# EAGLE design Artemis Charger Mod PCB (EAGLE 7.5.0)
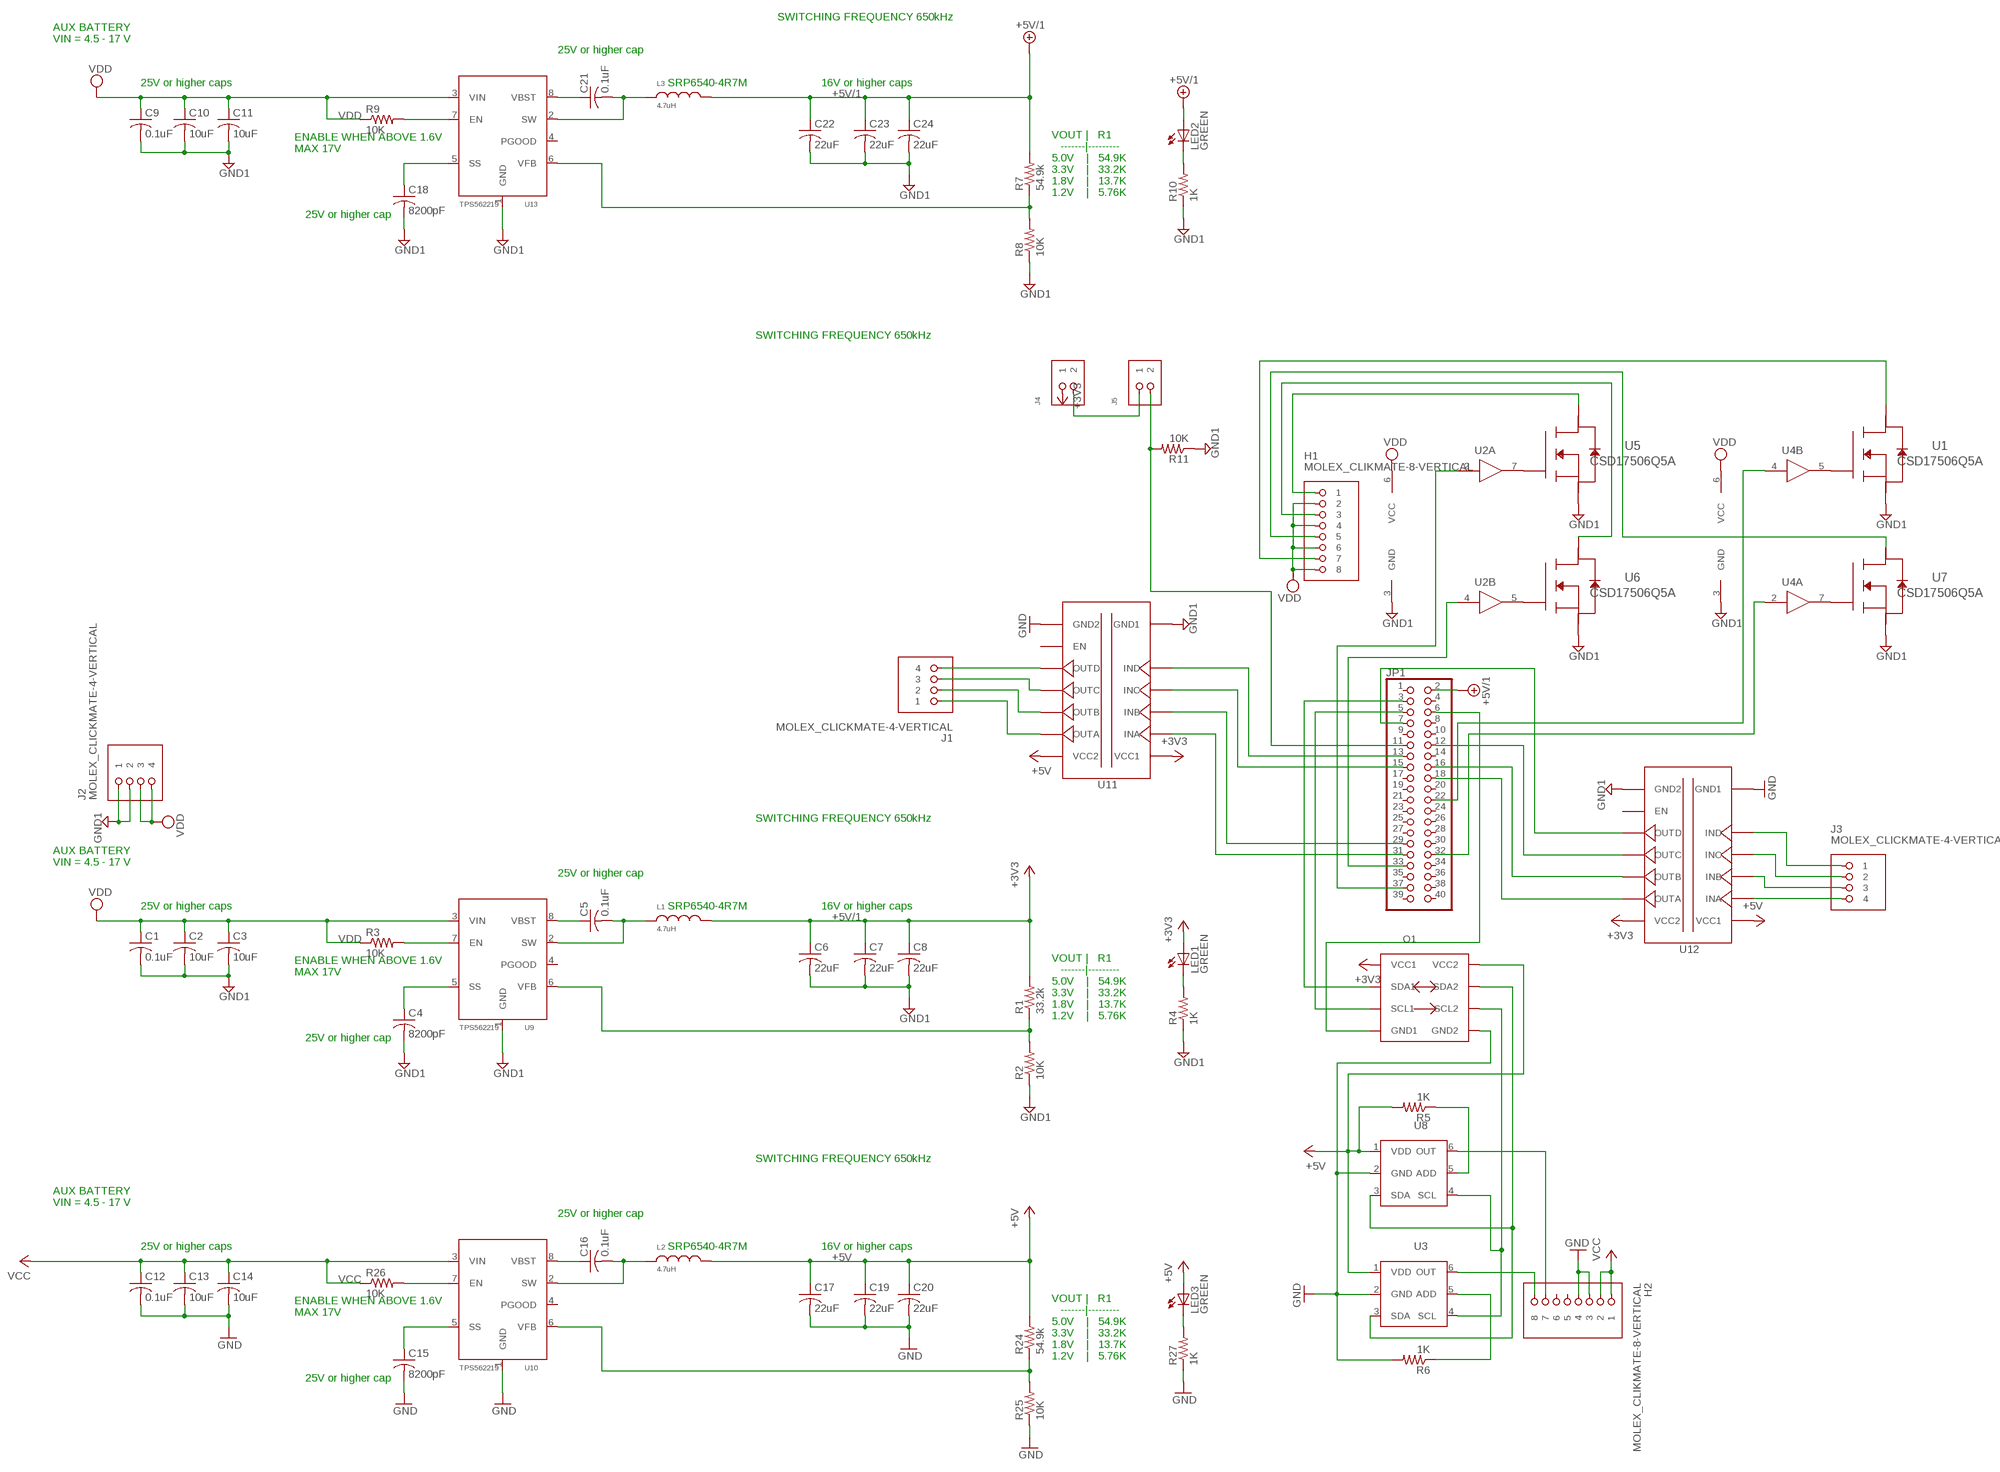
[diagram p0: schematic, sheet 1]

## Parts
C1  0.1uF  C-USC0805  [C0805]
C2  10uF  C-USC0805  [C0805]
C3  10uF  C-USC0805  [C0805]
C4  8200pF  C-USC0805  [C0805]
C5  0.1uF  C-USC0805  [C0805]
C6  22uF  C-USC0805  [C0805]
C7  22uF  C-USC0805  [C0805]
C8  22uF  C-USC0805  [C0805]
C9  0.1uF  C-USC0805  [C0805]
C10  10uF  C-USC0805  [C0805]
C11  10uF  C-USC0805  [C0805]
C12  0.1uF  C-USC0805  [C0805]
C13  10uF  C-USC0805  [C0805]
C14  10uF  C-USC0805  [C0805]
C15  8200pF  C-USC0805  [C0805]
C16  0.1uF  C-USC0805  [C0805]
C17  22uF  C-USC0805  [C0805]
C18  8200pF  C-USC0805  [C0805]
C19  22uF  C-USC0805  [C0805]
C20  22uF  C-USC0805  [C0805]
C21  0.1uF  C-USC0805  [C0805]
C22  22uF  C-USC0805  [C0805]
C23  22uF  C-USC0805  [C0805]
C24  22uF  C-USC0805  [C0805]
H1  MOLEX_CLIKMATE-8-VERTICAL  [MOLEX-CLIKMATE-8-VERTICAL-HEADER]
H2  MOLEX_CLIKMATE-8-VERTICAL  [MOLEX-CLIKMATE-8-VERTICAL-HEADER]
J1  MOLEX_CLICKMATE-4-VERTICAL  [MOLEX-CLIKMATE-4-VERTICAL-HEADER]
J2  MOLEX_CLICKMATE-4-VERTICAL  [MOLEX-CLIKMATE-4-VERTICAL-HEADER]
J3  MOLEX_CLICKMATE-4-VERTICAL  [MOLEX-CLIKMATE-4-VERTICAL-HEADER]
J4  MOLEX_CLICKMATE-2-VERTICAL  [MOLEX-CLIKMATE-2-VERTICAL-HEADER]
J5  MOLEX_CLICKMATE-2-VERTICAL  [MOLEX-CLIKMATE-2-VERTICAL-HEADER]
JP1  PINHD-2X20  [2X20]
L1  4.7uH  SRP6540  [SRP6540]
L2  4.7uH  SRP6540  [SRP6540]
L3  4.7uH  SRP6540  [SRP6540]
LED1  GREEN  LEDCHIPLED_0805  [CHIPLED_0805]
LED2  GREEN  LEDCHIPLED_0805  [CHIPLED_0805]
LED3  GREEN  LEDCHIPLED_0805  [CHIPLED_0805]
O1  ISO1541  [ISO1541]
R1  33.2k  R-US_R0805  [R0805]
R2  10K  R-US_R0805  [R0805]
R3  10K  R-US_R0805  [R0805]
R4  1K  R-US_R0805  [R0805]
R5  1K  R-US_R0805  [R0805]
R6  1K  R-US_R0805  [R0805]
R7  54.9k  R-US_R0805  [R0805]
R8  10K  R-US_R0805  [R0805]
R9  10K  R-US_R0805  [R0805]
R10  1K  R-US_R0805  [R0805]
R11  10K  R-US_R0805  [R0805]
R24  54.9k  R-US_R0805  [R0805]
R25  10K  R-US_R0805  [R0805]
R26  10K  R-US_R0805  [R0805]
R27  1K  R-US_R0805  [R0805]
U1  CSD17506Q5A  [SON_5X6]
U2  FAN3214  [FAN3214]
U3  MAX5812  MAX5812M  [MAX5812]
U4  FAN3214  [FAN3214]
U5  CSD17506Q5A  [SON_5X6]
U6  CSD17506Q5A  [SON_5X6]
U7  CSD17506Q5A  [SON_5X6]
U8  MAX5812  MAX5812M  [MAX5812]
U9  TPS562219  [TPS562219]
U10  TPS562219  [TPS562219]
U11  ISO7340  [ISO734X]
U12  ISO7340  [ISO734X]
U13  TPS562219  [TPS562219]

## Nets
+5V: C17.1 C19.1 C20.1 L2.P$2 LED3.A O1.8(VCC2) R5.2 R24.2 U3.1(VDD) U8.1(VDD) U11.P$16(VCC2) U12.P$1(VCC1)
+5V/1: C6.1 C7.1 C8.1 C22.1 C23.1 C24.1 J4.1 JP1.2 L1.P$2 L3.P$2 LED1.A LED2.A O1.1(VCC1) R1.2 R7.2 U11.P$1(VCC1) U12.P$16(VCC2) ; supply symbol labelled +3V3
GND: C12.2 C13.2 C14.2 C15.2 C17.2 C19.2 C20.2 H2.3 H2.4 O1.5(GND2) R6.2 R25.1 R27.1 U3.2(GND) U8.2(GND) U10.1(GND) U11.P$9(GND2) U11.P$15(GND2) U12.P$2(GND1) U12.P$8(GND1)
GND1: C1.2 C2.2 C3.2 C4.2 C6.2 C7.2 C8.2 C9.2 C10.2 C11.2 C18.2 C22.2 C23.2 C24.2 J2.1 J2.2 R2.1 R4.1 R8.1 R10.1 R11.1 U1.1(S) U1.2(S) U1.3(S) U2.3(GND) U4.3(GND) U5.1(S) U5.2(S) U5.3(S) U6.1(S) U6.2(S) U6.3(S) U7.1(S) U7.2(S) U7.3(S) U9.1(GND) U11.P$2(GND1) U11.P$8(GND1) U12.P$9(GND2) U12.P$15(GND2) U13.1(GND)
N$1: R3.2 U9.7(EN)
N$2: LED1.C R4.2
N$3: U2.5(B:OUT) U6.4(G)
N$4: R5.1 U8.5(ADD)
N$5: JP1.31 U11.P$3(INA)
N$6: U4.7(A:OUT) U7.4(G)
N$7: O1.7(SDA2) U3.3(SDA) U8.3(SDA)
N$8: O1.6(SCL2) U3.4(SCL) U8.4(SCL)
N$9: JP1.3 O1.2(SDA1)
N$10: JP1.5 O1.3(SCL1)
N$11: R6.1 U3.5(ADD)
N$12: U1.4(G) U4.5(B:OUT)
N$13: JP1.32 U4.2(A:IN)
N$14: U2.7(A:OUT) U5.4(G)
N$15: JP1.33 U2.4(B:IN)
N$16: JP1.37 U2.2(A:IN)
N$17: JP1.22 U4.4(B:IN)
N$18: JP1.6 O1.4(GND1)
N$19: H1.1 U5.5(D) U5.6(D) U5.7(D) U5.8(D) U5.PAD1(D) U5.PAD(D) U5.VIA1(D) U5.VIA2(D) U5.VIA3(D) U5.VIA4(D) U5.VIA5(D) U5.VIA6(D) U5.VIA7(D) U5.VIA8(D) U5.VIA9(D)
N$20: H1.3 U6.5(D) U6.6(D) U6.7(D) U6.8(D) U6.PAD1(D) U6.PAD(D) U6.VIA1(D) U6.VIA2(D) U6.VIA3(D) U6.VIA4(D) U6.VIA5(D) U6.VIA6(D) U6.VIA7(D) U6.VIA8(D) U6.VIA9(D)
N$21: H1.5 U7.5(D) U7.6(D) U7.7(D) U7.8(D) U7.PAD1(D) U7.PAD(D) U7.VIA1(D) U7.VIA2(D) U7.VIA3(D) U7.VIA4(D) U7.VIA5(D) U7.VIA6(D) U7.VIA7(D) U7.VIA8(D) U7.VIA9(D)
N$22: H1.7 U1.5(D) U1.6(D) U1.7(D) U1.8(D) U1.PAD1(D) U1.PAD(D) U1.VIA1(D) U1.VIA2(D) U1.VIA3(D) U1.VIA4(D) U1.VIA5(D) U1.VIA6(D) U1.VIA7(D) U1.VIA8(D) U1.VIA9(D)
N$23: R26.2 U10.7(EN)
N$24: JP1.29 U11.P$4(INB)
N$25: H2.8 U3.6(OUT)
N$26: H2.7 U8.6(OUT)
N$27: JP1.13 U11.P$6(IND)
N$28: LED3.C R27.2
N$29: JP1.15 U11.P$5(INC)
N$30: J1.4 U11.P$11(OUTD)
N$31: J1.3 U11.P$12(OUTC)
N$32: J1.2 U11.P$13(OUTB)
N$33: J1.1 U11.P$14(OUTA)
N$34: J3.4 U12.P$3(INA)
N$35: J3.3 U12.P$4(INB)
N$36: J3.2 U12.P$5(INC)
N$37: J3.1 U12.P$6(IND)
N$38: JP1.18 U12.P$14(OUTA)
N$39: JP1.16 U12.P$13(OUTB)
N$40: JP1.12 U12.P$12(OUTC)
N$41: JP1.7 U12.P$11(OUTD)
N$42: J4.2 J5.1
N$43: J5.2 JP1.11 R11.2
N$44: R9.2 U13.7(EN)
N$45: LED2.C R10.2
SS_5V: C15.1 U10.5(SS)
SS_5V1: C4.1 U9.5(SS)
SS_5V2: C18.1 U13.5(SS)
SW_5V: C16.2 L2.P$1 U10.2(SW)
SW_5V1: C5.2 L1.P$1 U9.2(SW)
SW_5V2: C21.2 L3.P$1 U13.2(SW)
VBST_5V: C16.1 U10.8(VBST)
VBST_5V1: C5.1 U9.8(VBST)
VBST_5V2: C21.1 U13.8(VBST)
VCC: C12.1 C13.1 C14.1 H2.1 H2.2 R26.1 U10.3(VIN)
VDD: C1.1 C2.1 C3.1 C9.1 C10.1 C11.1 H1.2 H1.4 H1.6 H1.8 J2.3 J2.4 R3.1 R9.1 U2.6(VCC) U4.6(VCC) U9.3(VIN) U13.3(VIN)
VFB_5V: R24.1 R25.2 U10.6(VFB)
VFB_5V1: R1.1 R2.2 U9.6(VFB)
VFB_5V2: R7.1 R8.2 U13.6(VFB)
Unconnected: H2.5 H2.6 JP1.1 JP1.4 JP1.8 JP1.9 JP1.10 JP1.14 JP1.17 JP1.19 JP1.20 JP1.21 JP1.23 JP1.24 JP1.25 JP1.26 JP1.27 JP1.28 JP1.30 JP1.34 JP1.35 JP1.36 JP1.38 JP1.39 JP1.40 U9.4(PGOOD) U10.4(PGOOD) U11.P$10(EN) U12.P$10(EN) U13.4(PGOOD)

## Notes on the sheet
- SWITCHING FREQUENCY 650kHz
- AUX BATTERY
  VIN = 4.5 - 17 V
- 25V or higher cap
- 25V or higher caps | SRP6540-4R7M | 16V or higher caps
- ENABLE WHEN ABOVE 1.6V
  MAX 17V
- VOUT |   R1
     -------|---------
  5.0V    |   54.9K
  3.3V    |   33.2K
  1.8V    |   13.7K
  1.2V    |   5.76K
- 25V or higher cap
- SWITCHING FREQUENCY 650kHz
- SWITCHING FREQUENCY 650kHz
- AUX BATTERY
  VIN = 4.5 - 17 V
- 25V or higher cap
- 25V or higher caps | SRP6540-4R7M | 16V or higher caps
- ENABLE WHEN ABOVE 1.6V
  MAX 17V
- VOUT |   R1
     -------|---------
  5.0V    |   54.9K
  3.3V    |   33.2K
  1.8V    |   13.7K
  1.2V    |   5.76K
- 25V or higher cap
- SWITCHING FREQUENCY 650kHz
- AUX BATTERY
  VIN = 4.5 - 17 V
- 25V or higher cap
- 25V or higher caps | SRP6540-4R7M | 16V or higher caps
- ENABLE WHEN ABOVE 1.6V
  MAX 17V
- VOUT |   R1
     -------|---------
  5.0V    |   54.9K
  3.3V    |   33.2K
  1.8V    |   13.7K
  1.2V    |   5.76K
- 25V or higher cap

## Library data of the parts
C1 C5 C9 C12 C16 C21 = adafruit:C-US: CAPACITOR, American symbol; PARTNO: GRM21BR71E104KA01L
C2 C3 C10 C11 C13 C14 = adafruit:C-US: CAPACITOR, American symbol; PARTNO: GRM21BR61E106KA73L
C4 C15 C18 = adafruit:C-US: CAPACITOR, American symbol; PARTNO: C0805C822K5RACTU
C6-C8 C17 C19 C20 C22-C24 = adafruit:C-US: CAPACITOR, American symbol; PARTNO: C2012JB1E226M125AC
H1 H2 = FormE:MOLEX_CLIKMATE-8-VERTICAL: 505405-0860
J1-J3 = FormE:MOLEX_CLICKMATE-4-VERTICAL: 5025840470
J4 J5 = FormE:MOLEX_CLICKMATE-2-VERTICAL: 5025840270
JP1 = pinhead:PINHD-2X20: PIN HEADER
L1-L3 = FormE:SRP6540; PARTNO: SRP6540-4R7M
LED1-LED3 = FormE:LED: LED OSRAM: - CHIPLED LG R971, LG N971, LY N971, LG Q971, LY Q971, LO R971, LY R971 LH N974, LH R974 LS Q976, LO Q976, LY Q976 LO Q996 - Hyper CHIPLED LW Q18S LB Q993, LB Q99A, LB R99A - SideLED LS A670, LO A670, LY A670, LG A670, LP A670 LB A673, LV A673, LT A673, LW A673 LH A674 LY A675 LS A676, LA A676, LO A676, LY A676, LW A676 LS A679, LY A679, LG A679 - Hyper Micro SIDELED® LS Y876, LA Y876, LO Y876, LY Y876 LT Y87S - SmartLED LW L88C, LW L88S LB L89C, LB L89S, LG L890 LS L89K, LO L89K, LY L89K LS L896, LA L896, LO L896, LY L896 - TOPLED LS T670, LO T670, LY T670, LG T670, LP T670 LSG T670, LSP T670, LSY T670, LOP T670, LYG T670 LG T671, LOG T671, LSG T671 LB T673, LV T673, LT T673, LW T673 LH T674 LS T676, LA T676, LO T676, LY T676, LB T676, LH T676, LSB T676, LW T676 LB T67C, LV T67C, LT T67C, LS T67K, LO T67K, LY T67K, LW E67C LS E67B, LA E67B, LO E67B, LY E67B, LB E67C, LV E67C, LT E67C LW T67C LS T679, LY T679, LG T679 LS T770, LO T770, LY T770, LG T770, LP T770 LB T773, LV T773, LT T773, LW T773 LH T774 LS E675, LA E675, LY E675, LS T675 LS T776, LA T776, LO T776, LY T776, LB T776 LHGB T686 LT T68C, LB T68C - Hyper Mini TOPLED® LB M676 - Mini TOPLED Santana® LG M470 LS M47K, LO M47K, LY M47K Source: http://www.osram.convergy.de/; PARTNO: 598-8170-107F
O1 = FormE:ISO1541
R1 R7 R24 = adafruit:R-US_: RESISTOR, American symbol; PARTNO: ERA-6AEB5492V
R2 R3 R8 R9 R11 R25 R26 = adafruit:R-US_: RESISTOR, American symbol; PARTNO: ERJ-6ENF1002V
R4-R6 R10 R27 = adafruit:R-US_: RESISTOR, American symbol; PARTNO: ERJ-6ENF1001V
U1 U5-U7 = FormE:CSD17506Q5A
U2 U4 = FormE:FAN3214
U3 U8 = FormE:MAX5812
U9 U10 U13 = FormE:TPS562219; PARTNO: TPS562219DDFT
U11 U12 = FormE:ISO7340

## Board
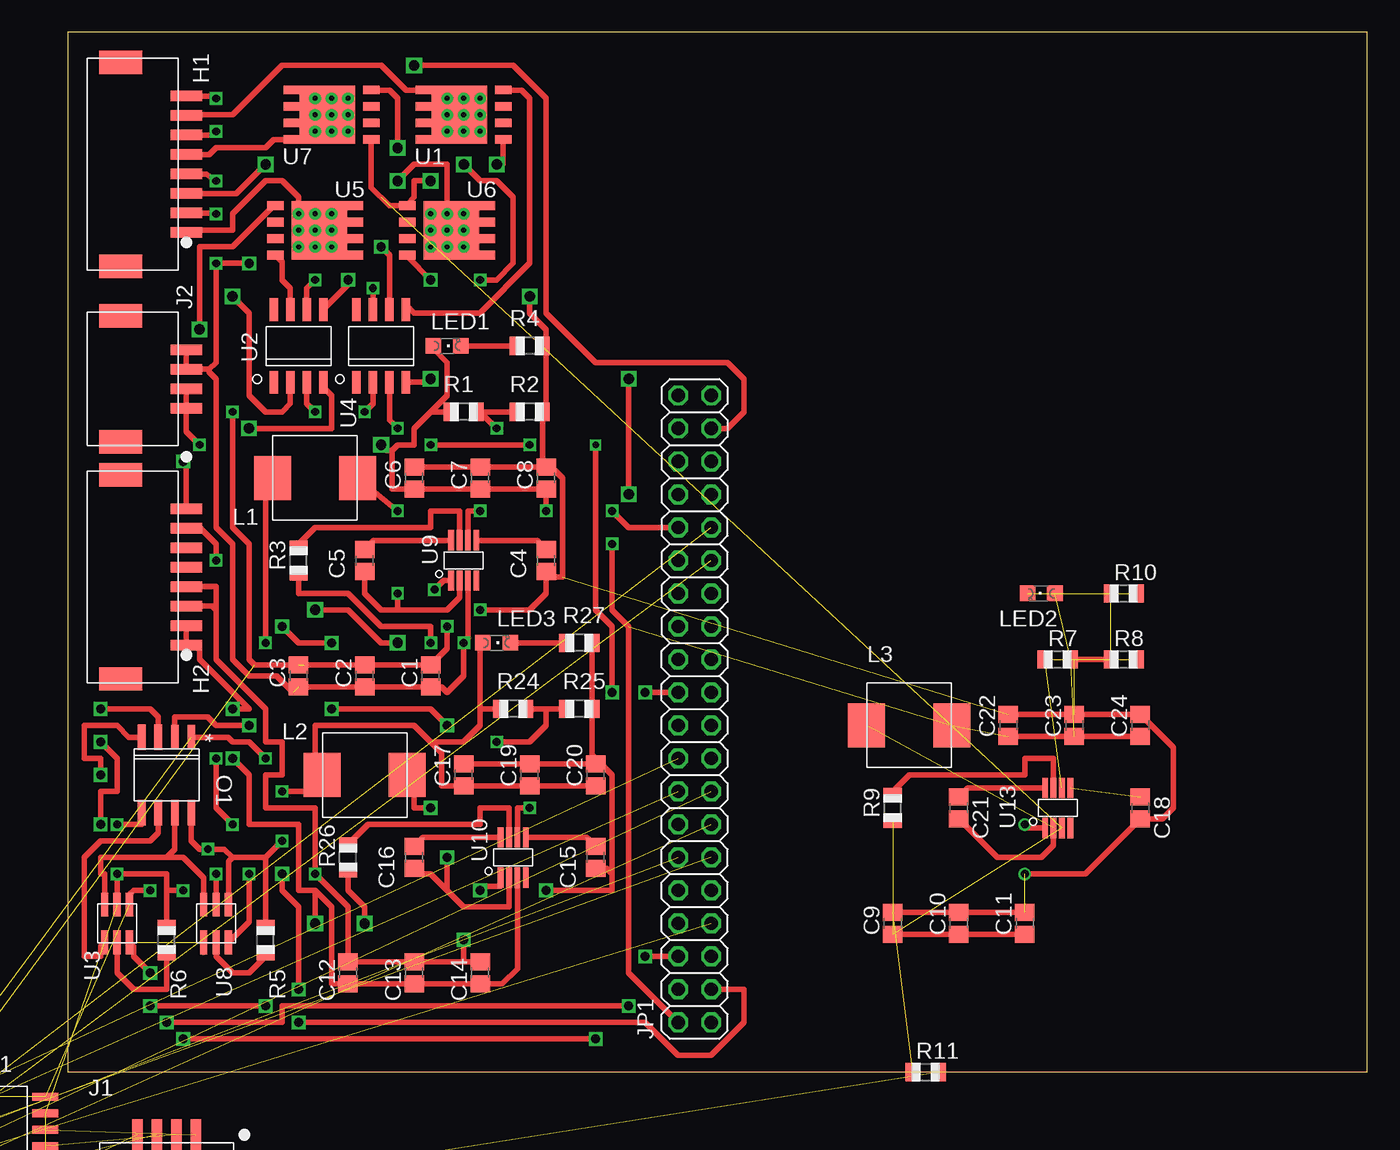
[diagram p1: board, top side]
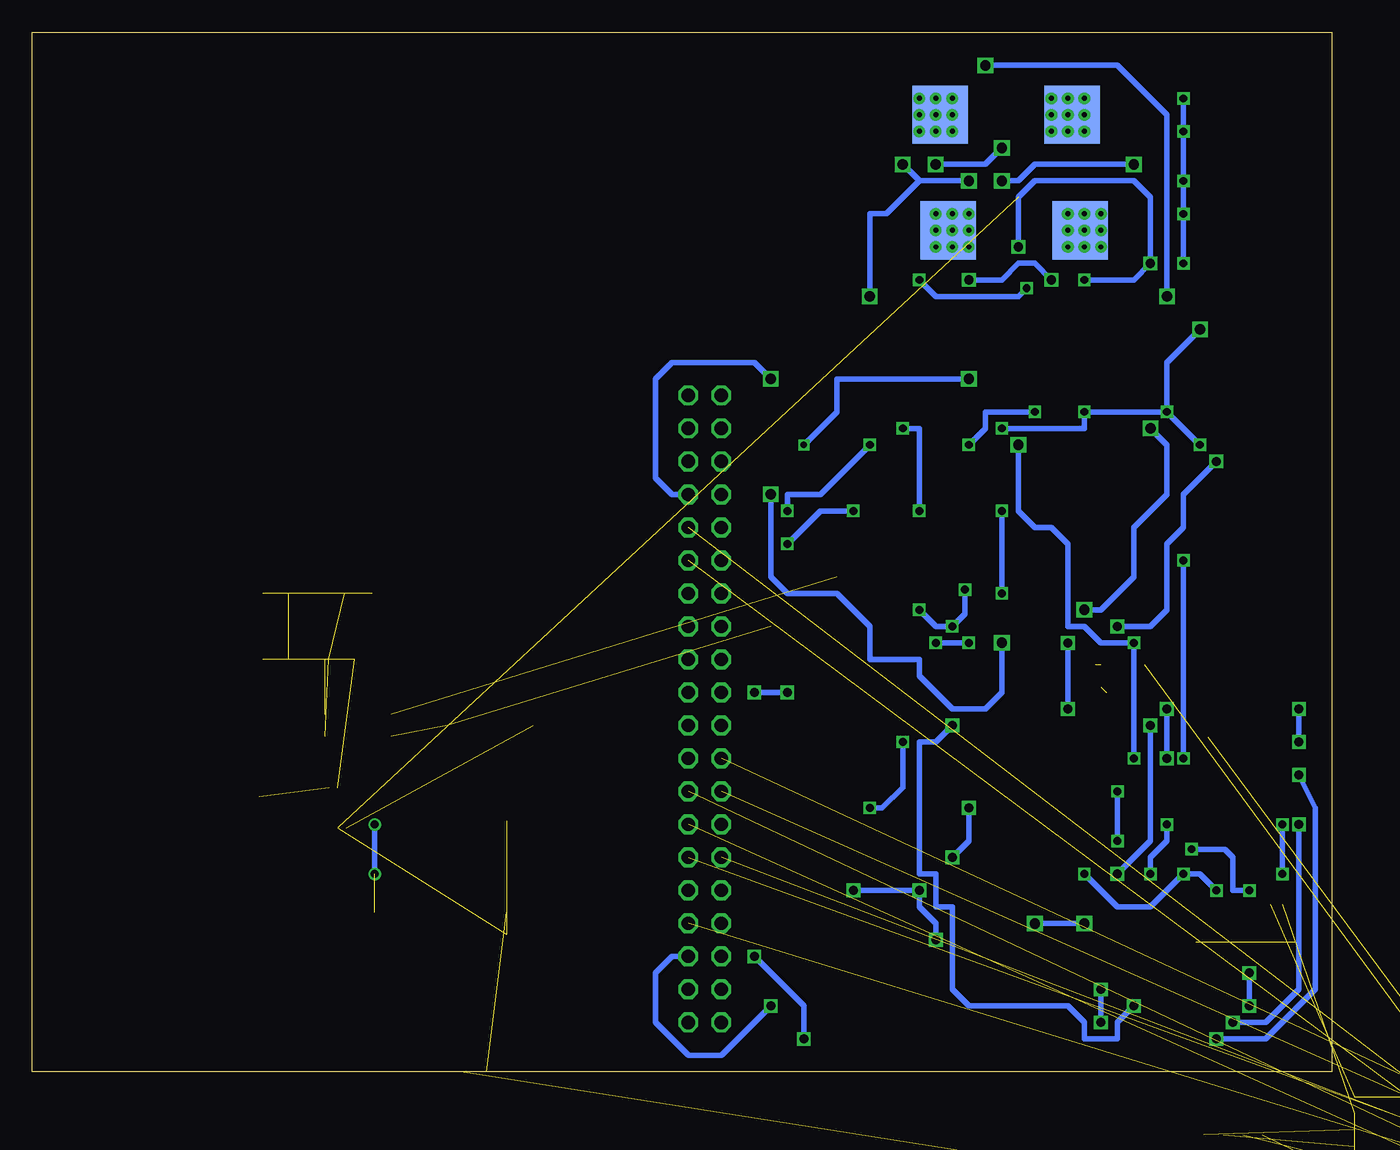
[diagram p2: board, bottom side, seen from below]

Size 100 x 80 mm. Coordinates in mm from the lower left corner, seen from the top.
Outline: 0,0 100,0 100,80 0,80 0,0
Copper layers (1*16): Top 0.0356mm / dielectric 1.5011mm / Bottom 0.0356mm
Design rules "OSH_PCB Rules": minimum track width 6mil, minimum drill 13mil, track to track 6mil, track to pad 6mil, pad to pad 6mil, via to via 6mil, smd to smd 6mil, copper to edge 15mil, drill to drill 6mil, minimum pad ring 7mil, minimum via ring 7mil, stop-mask expansion 3mil, vias tented up to drill 0mil, thermal gap 10mil

### Footprints (pad centres in the part's own frame; a part is rotated, then mirrored left to right if it is on the bottom)
C0805 = smd 1.3 x 1.5: 1 -0.85,0; 2 0.85,0
MOLEX-CLIKMATE-8-VERTICAL-HEADER = smd 0.8 x 2.4: 1 5.25,4.064; 2 3.75,4.064; 3 2.25,4.064; 4 0.75,4.064; 5 -0.75,4.064; 6 -2.25,4.064; 7 -3.75,4.064; 8 -5.25,4.064 | smd 1.8 x 3.3: M1 7.85,-0.986; M2 -7.85,-0.986
MOLEX-CLIKMATE-4-VERTICAL-HEADER = smd 0.8 x 2.4: 1 2.25,4.064; 2 0.75,4.064; 3 -0.75,4.064; 4 -2.25,4.064 | smd 1.8 x 3.3: M1 4.85,-0.986; M2 -4.85,-0.986
MOLEX-CLIKMATE-2-VERTICAL-HEADER = smd 0.8 x 2.4: 1 0.75,4.064; 2 -0.75,4.064 | smd 1.8 x 3.3: M1 3.35,-0.986; M2 -3.35,-0.986
2X20 = drill 1.016 octagon: 1 -24.13,-1.27; 2 -24.13,1.27; 3 -21.59,-1.27; 4 -21.59,1.27; 5 -19.05,-1.27; 6 -19.05,1.27; 7 -16.51,-1.27; 8 -16.51,1.27; 9 -13.97,-1.27; 10 -13.97,1.27; 11 -11.43,-1.27; 12 -11.43,1.27; 13 -8.89,-1.27; 14 -8.89,1.27; 15 -6.35,-1.27; 16 -6.35,1.27; 17 -3.81,-1.27; 18 -3.81,1.27; 19 -1.27,-1.27; 20 -1.27,1.27; 21 1.27,-1.27; 22 1.27,1.27; 23 3.81,-1.27; 24 3.81,1.27; 25 6.35,-1.27; 26 6.35,1.27; 27 8.89,-1.27; 28 8.89,1.27; 29 11.43,-1.27; 30 11.43,1.27; 31 13.97,-1.27; 32 13.97,1.27; 33 16.51,-1.27; 34 16.51,1.27; 35 19.05,-1.27; 36 19.05,1.27; 37 21.59,-1.27; 38 21.59,1.27; 39 24.13,-1.27; 40 24.13,1.27
SRP6540 = smd 2.85 x 3.4: P$1 -3.275,0; P$2 3.275,0
CHIPLED_0805 = smd 1.2 x 1.2: A 0,-1.05; C 0,1.05
ISO1541 = smd 1.9 x 0.6: 1 -2.9,1.905; 2 -2.9,0.635 | smd 1.98 x 0.6: 3 -2.9,-0.635; 4 -2.9,-1.905; 5 2.9,-1.905; 6 2.9,-0.635; 7 2.9,0.635; 8 2.9,1.905
R0805 = smd 1.1 x 1.4: 1 -1,0; 2 1,0
SON_5X6 = smd 1.27 x 0.66: 1 3.048,-1.905; 2 3.048,-0.635; 3 3.048,0.635; 4 3.048,1.905; 5 -3.048,1.905; 6 -3.048,0.635; 7 -3.048,-0.635; 8 -3.048,-1.905 | smd 4.267 x 4.47 bottom: PAD -0.33,0 | smd 4.267 x 4.47: PAD1 -0.33,0 | drill 0.381 pad 0.889: VIA1 -1.27,1.27; VIA2 0,1.27; VIA3 1.27,1.27; VIA4 -1.27,0; VIA5 0,0; VIA6 1.27,0; VIA7 -1.27,-1.27; VIA8 0,-1.27; VIA9 1.27,-1.27
FAN3214 = smd 1.75 x 0.65: 1 -2.8,1.905; 2 -2.8,0.635; 3 -2.8,-0.635; 4 -2.8,-1.905; 5 2.8,-1.905; 6 2.8,-0.635; 7 2.8,0.635; 8 2.8,1.905
MAX5812 = smd 1.83 x 0.56: 1 -1.45,0.95; 2 -1.45,0; 3 -1.45,-0.95; 4 1.45,-0.95; 5 1.45,0; 6 1.45,0.95
TPS562219 = smd 1.55 x 0.45: 1 -1.55,0.975; 2 -1.55,0.325; 3 -1.55,-0.325; 4 -1.55,-0.975; 5 1.55,-0.975; 6 1.55,-0.325; 7 1.55,0.325; 8 1.55,0.975
ISO734X = smd 2 x 0.6: P$1 -4.65,4.445; P$2 -4.65,3.175; P$3 -4.65,1.905; P$4 -4.65,0.635; P$5 -4.65,-0.635; P$6 -4.65,-1.905; P$7 -4.65,-3.175; P$8 -4.65,-4.445; P$9 4.65,-4.445; P$10 4.65,-3.175; P$11 4.65,-1.905; P$12 4.65,-0.635; P$13 4.65,0.635; P$14 4.65,1.905; P$15 4.65,3.175; P$16 4.65,4.445

### Placement (x,y rotation side)
C1  27.94,30.48 90 top
C2  22.86,30.48 90 top
C3  17.78,30.48 90 top
C4  36.83,39.37 270 top
C5  22.86,39.37 270 top
C6  26.67,45.72 90 top
C7  31.75,45.72 90 top
C8  36.83,45.72 90 top
C9  63.5,11.43 90 top
C10  68.58,11.43 90 top
C11  73.66,11.43 90 top
C12  21.59,7.62 90 top
C13  26.67,7.62 90 top
C14  31.75,7.62 90 top
C15  40.64,16.51 270 top
C16  26.67,16.51 270 top
C17  30.48,22.86 90 top
C18  82.55,20.32 270 top
C19  35.56,22.86 90 top
C20  40.64,22.86 90 top
C21  68.58,20.32 270 top
C22  72.39,26.67 90 top
C23  77.47,26.67 90 top
C24  82.55,26.67 90 top
H1  5.08,69.85 270 top
H2  5.08,38.1 270 top
J1  7.62,-8.89 0 top  (outside the outline)
J2  5.08,53.34 270 top
J3  -17.78,-21.59 0 top  (outside the outline)
J4  -30.48,-21.59 0 top  (outside the outline)
J5  -43.18,-21.59 0 top  (outside the outline)
JP1  48.26,27.94 90 top
L1  19.05,45.72 180 top
L2  22.86,22.86 180 top
L3  64.77,26.67 0 top
LED1  29.21,55.88 270 top
LED2  74.93,36.83 90 top
LED3  33.02,33.02 270 top
O1  7.62,22.86 270 top
R1  30.48,50.8 180 top
R2  35.56,50.8 180 top
R3  17.78,39.37 90 top
R4  35.56,55.88 180 top
R5  15.24,10.16 90 top
R6  7.62,10.16 90 top
R7  76.2,31.75 0 top
R8  81.28,31.75 0 top
R9  63.5,20.32 90 top
R10  81.28,36.83 0 top
R11  66.04,0 0 top
R24  34.29,27.94 180 top
R25  39.37,27.94 180 top
R26  21.59,16.51 90 top
R27  39.37,33.02 180 top
U1  30.48,73.66 0 top
U2  17.78,55.88 90 top
U3  3.81,11.43 270 top
U4  24.13,55.88 90 top
U5  19.05,64.77 180 top
U6  29.21,64.77 180 top
U7  20.32,73.66 0 top
U8  11.43,11.43 270 top
U9  30.48,39.37 90 top
U10  34.29,16.51 90 top
U11  -6.35,-6.35 0 top
U12  -19.05,-6.35 0 top  (outside the outline)
U13  76.2,20.32 90 top

### Tracks (layer width: path | path; a pad name or v marks a point on that pad's centre or on a via)
+5V  (via drill 0.6)  (2 unrouted)
  Top 0.406: U3.1 4.76,13.65 5.08,13.97 v6.35,13.97 | C17.1 C19.1 C20.1 28.79,22.01 28.79,24.55 27.94,25.4 | 19.05,22.86 19.05,26.67 26.67,26.67 27.94,25.4 | 19.05,22.86 L2.P$2 | 31.75,27.94 31.75,32.8 LED3.A | R24.2 31.75,27.94 | v16.51,17.78 15.24,16.51 | 15.24,16.51 R5.2 | 12.7,16.51 12.06,17.14 v10.79,17.14 10.16,17.14 9.53,17.78 O1.8 | 12.7,16.51 15.24,16.51 | v16.51,21.59 19.05,21.59 19.05,22.86 | 27.94,25.4 30.48,25.4 31.75,26.67 31.75,27.94 | U8.1 12.38,16.19 12.7,16.51
  Bottom 0.406: v6.35,13.97 7.62,13.97 7.62,16.51 8.26,17.14 v10.79,17.14 | v16.51,21.59 v16.51,17.78
+5V/1  (via drill 0.6, 0.8)  (7 unrouted)
  Top 0.406: 15.24,46.26 L1.P$2 15.78,44.98 15.24,44.45 v15.24,33.02 | R1.2 27.94,50.8 | v36.83,43.18 C8.1 C7.1 C6.1 24.98,44.87 24.98,47.84 | v41.91,40.64 41.91,35.56 43.18,34.29 43.18,7.62 JP1.2 | LED1.A 28.16,55.66 29.21,54.61 29.21,52.07 27.94,50.8 | O1.1 12.34,25.76 12.7,25.4 13.97,25.4 v15.24,24.13 | 24.98,47.84 24.55,47.84 v24.13,48.26 | 24.98,47.84 25.4,48.26 26.67,48.26 26.67,49.53 27.94,50.8 | C24.1 C23.1 C22.1
  Bottom 0.406: v36.83,43.18 39.37,43.18 v41.91,40.64 | v24.13,48.26 24.13,43.18 22.86,41.91 21.59,41.91 20.32,40.64 20.32,34.29 19.05,34.29 17.78,33.02 v15.24,33.02 v15.24,24.13
GND  (via drill 0.6, 0.7)  (4 unrouted)
  Top 0.406: R6.2 7.62,13.97 | U3.2 v3.81,15.24 7.62,15.24 7.62,13.97 | O1.5 5.71,19.05 v3.81,19.05 | 11.43,12.7 U8.2 v11.43,15.24 | v8.89,13.97 7.62,13.97 | C20.2 C19.2 C17.2 | R27.1 R25.1 40.37,24.4 40.64,24.13 C20.2 | C20.2 41.06,23.71 41.91,22.86 41.91,15.24 | 41.91,15.24 41.91,13.97 v36.83,13.97 | 11.43,35.56 11.43,31.75 15.24,27.94 15.24,25.4 16.51,25.4 16.51,22.86 15.24,22.86 15.24,20.32 19.05,20.32 v19.05,15.24 21.59,12.7 C12.2 C13.2 C14.2 30.48,8.47 v30.48,10.16 | 11.43,35.56 11.14,35.85 H2.3 | H2.4 11.43,37.35 11.43,35.56 | U10.1 33.31,14.27 32.05,14.27 v31.75,13.97 | C15.2 41.49,15.66 41.91,15.24
  Bottom 0.406: v3.81,19.05 v3.81,15.24 | v19.05,15.24 16.51,12.7 13.97,12.7 v11.43,15.24 10.16,15.24 v8.89,13.97 | v36.83,13.97 v31.75,13.97 31.75,12.7 30.48,11.43 v30.48,10.16
GND1  (via drill 0.6, 0.8)  (10 unrouted)
  Top 0.406: 17.78,31.75 18.2,31.33 C2.2 C1.2 29.21,32.6 v29.21,34.29 | 17.36,31.75 C3.2 14.39,31.33 13.97,31.75 13.97,40.64 12.7,41.91 v12.7,50.8 | C8.2 C7.2 C6.2 | C8.2 37.25,46.57 38.1,45.72 38.1,38.1 36.83,38.1 C4.2 36.83,36.83 35.56,35.56 v31.75,35.56 | C8.2 36.56,46.84 R2.1 36.83,50.8 36.83,55.61 R4.1 36.83,55.88 36.83,57.15 35.56,58.42 v35.56,59.69 | U2.3 18.41,51.44 v19.05,50.8 | v28.23,37.12 28.93,37.82 U9.1 | U4.3 24.77,50.16 v25.4,49.53 | J2.2 J2.1 9.14,49.28 v10.16,48.26 | U5.1 15.88,66.67 12.7,63.5 10.16,63.5 v10.16,57.15 | U7.1 23.37,68.07 24.77,66.67 U6.1 26.16,66.8 26.67,67.31 26.67,68.58 v27.94,68.58 | v33.02,69.85 33.53,69.85 U1.1 | C9.2 C10.2 C11.2 | C22.2 C23.2 C24.2 85.09,24.98 85.09,20.32 84.24,19.47 C18.2 78.32,15.24 v73.66,15.24 | R8.1 77.47,31.75 | U13.1 73.94,18.77 v73.66,19.05
  Bottom 0.406: v28.23,37.12 28.23,35.27 v29.21,34.29 30.48,34.29 v31.75,35.56 | v25.4,49.53 19.05,49.53 v19.05,50.8 v12.7,50.8 | v10.16,48.26 v12.7,50.8 | v10.16,57.15 12.7,54.61 v12.7,50.8 | v27.94,68.58 31.75,68.58 | 31.75,68.58 v33.02,69.85 | v35.56,59.69 35.56,66.04 34.29,66.04 31.75,68.58 | v73.66,19.05 v73.66,15.24
N$1
  Top 0.406: R3.2 17.78,40.64 19.05,41.91 27.94,41.91 27.94,43.18 30.16,43.18 U9.7
N$2
  Top 0.406: LED1.C R4.2
N$3  (via drill 0.7)
  Top 0.406: 19.68,59.05 U2.5 21.59,60.59 v21.59,60.96 | v27.94,60.96 26.16,62.74 U6.4
  Bottom 0.406: v27.94,60.96 25.4,60.96 24.13,62.23 22.86,62.23 v21.59,60.96
N$4
  Top 0.406: U8.5 11.43,8.89 12.7,7.62 13.97,7.62 15.24,8.89 R5.1
N$5  (1 unrouted)
N$6  (via drill 0.6, 0.8)
  Top 0.406: U4.7 v23.5,60.33 | v31.75,60.96 33.02,60.96 34.29,62.23 34.29,67.31 33.02,68.58 31.75,68.58 v30.48,69.85 | v25.4,71.12 25.4,74.93 24.77,75.56 U7.4
  Bottom 0.406: v23.5,60.33 24.13,59.69 30.48,59.69 v31.75,60.96 | v25.4,71.12 26.67,69.85 v30.48,69.85
N$7
  Top 0.406: U8.3 10.48,14.92 8.89,16.51 7.62,16.51 | 7.62,16.51 2.54,16.51 2.54,15.24 2.86,15.24 U3.3 | O1.7 8.26,17.14 7.62,16.51
N$8  (1 unrouted)
  Top 0.406: O1.6 6.99,18.41 6.35,17.78 2.54,17.78 1.27,16.51 1.27,8.89 2.54,8.89 2.54,9.66 U3.4 | U8.4 10.48,9.21
N$9  (via drill 0.7)
  Top 0.406: O1.2 8.26,27.3 10.79,27.3 11.43,26.67 v13.97,26.67 | v16.51,15.24 16.51,13.97 17.78,12.7 v17.78,6.35 | v17.78,3.81 44.45,3.81 46.99,1.27 49.53,1.27 52.07,3.81 52.07,6.35 JP1.3
  Bottom 0.406: v13.97,26.67 13.97,17.78 v16.51,15.24 | v17.78,6.35 v17.78,3.81
N$10  (via drill 0.7)
  Top 0.406: O1.3 6.99,27.3 6.35,27.94 v2.54,27.94 | v2.54,25.4 3.81,24.13 3.81,21.59 2.54,21.59 v2.54,19.05 | v7.62,3.81 16.51,3.81 16.51,5.08 v43.18,5.08
  Bottom 0.406: v2.54,27.94 v2.54,25.4 | v2.54,19.05 2.54,6.35 5.08,3.81 v7.62,3.81 | v43.18,5.08 46.99,1.27 49.53,1.27 52.07,3.81 52.07,7.62 50.8,8.89 JP1.5
N$11
  Top 0.406: U3.5 3.81,7.62 5.08,6.35 7.62,6.35 R6.1
N$12
  Top 0.406: U4.5 26.04,59.05 26.67,58.42 31.75,58.42 35.56,62.23 35.56,74.93 34.92,75.56 U1.4
N$13  (via drill 0.6)
  Top 0.406: v27.94,48.26 v35.56,48.26 | U4.2 23.5,51.44 v22.86,50.8 | v41.91,43.18 43.18,41.91 JP1.32
  Bottom 0.406: v22.86,50.8 26.67,50.8 26.67,49.53 v27.94,48.26 | v35.56,48.26 39.37,44.45 41.91,44.45 v41.91,43.18
N$14
  Top 0.406: U2.7 17.14,60.33 16.51,60.96 16.51,62.36 U5.4
N$15  (via drill 0.8)
  Top 0.406: U2.4 19.68,52.7 20.32,52.07 20.32,49.53 v13.97,49.53 | v19.05,35.56 21.59,35.56 24.13,33.02 v25.4,33.02 | v43.18,44.45 v43.18,53.34
  Bottom 0.406: v25.4,33.02 25.4,29.21 26.67,27.94 29.21,27.94 31.75,30.48 31.75,31.75 35.56,31.75 35.56,34.29 38.1,36.83 41.91,36.83 43.18,38.1 v43.18,44.45 | v43.18,53.34 44.45,54.61 50.8,54.61 52.07,53.34 52.07,45.72 50.8,44.45 JP1.33 | v19.05,35.56 17.78,35.56 15.24,38.1 15.24,41.91 12.7,44.45 12.7,48.26 v13.97,49.53
N$16  (via drill 0.8)
  Top 0.406: U2.2 17.14,51.44 16.51,50.8 15.24,50.8 13.97,52.07 13.97,58.42 v12.7,59.69 | JP1.37 50.8,49.53 52.07,50.8 52.07,53.34 50.8,54.61 40.64,54.61 36.83,58.42 36.83,74.93 34.29,77.47 v26.67,77.47
  Bottom 0.406: v12.7,59.69 12.7,73.66 16.51,77.47 v26.67,77.47
N$17  (via drill 0.5, 0.7, 0.8)
  Top 0.406: v41.91,29.21 41.91,34.29 40.64,35.56 v40.64,48.26 | v44.45,29.21 JP1.22 | U4.4 27.68,53.08 v27.94,53.34
  Bottom 0.406: v41.91,29.21 v44.45,29.21 | v27.94,53.34 38.1,53.34 38.1,50.8 v40.64,48.26
N$18  (via drill 0.7)
  Top 0.406: O1.4 4.72,25.76 3.81,26.67 1.27,26.67 1.27,24.13 2.54,24.13 v2.54,22.86 | v8.89,2.54 v40.64,2.54 | v44.45,8.89 JP1.6
  Bottom 0.406: v8.89,2.54 5.08,2.54 1.27,6.35 1.27,20.32 v2.54,22.86 | v40.64,2.54 40.64,5.08 v44.45,8.89
N$19
  Top 0.406: 17.61,64.6 U5.VIA6 | U5.VIA9 17.78,67.31 16.51,68.58 15.24,68.58 12.7,66.04 12.7,64.77 10.16,64.77 H1.1
N$20  (via drill 0.8)
  Top 0.406: H1.3 12.99,67.6 v15.24,69.85 | v25.4,68.58 26.67,69.85 29.21,69.85 U6.VIA8
  Bottom 0.406: v25.4,68.58 24.13,68.58 22.86,69.85 v15.24,69.85
N$21
  Top 0.406: H1.5 10.91,70.6 11.43,71.12 15.24,71.12 15.88,71.75 U7.8
N$22
  Top 0.406: H1.7 9.2,73.66 12.7,73.66 16.51,77.47 24.13,77.47 26.04,75.56 U1.5 27.3,75.56
N$23
  Top 0.406: R26.2 23.13,19.05 31.75,19.05 31.75,20.32 33.97,20.32 U10.7
N$24  (1 unrouted)
N$25  (via drill 0.7)
  Top 0.406: v16.51,34.29 17.78,33.02 v20.32,33.02 | v15.24,5.08 v6.35,5.08 | v6.35,7.62 5.08,8.89 5.08,9.66 U3.6 | v20.32,27.94 27.94,27.94 v29.21,26.67 | H2.8 9.14,46.74 v8.89,46.99
  Bottom 0.406: v20.32,33.02 v20.32,27.94 | v15.24,5.08 16.51,3.81 16.51,2.54 19.05,2.54 19.05,3.81 20.32,5.08 27.94,5.08 29.21,6.35 29.21,12.7 30.48,12.7 30.48,15.24 31.75,15.24 31.75,25.4 30.48,25.4 v29.21,26.67 | v6.35,5.08 v6.35,7.62 | v16.51,34.29 13.97,34.29 12.7,35.56 12.7,40.64 11.43,41.91 11.43,44.45 v8.89,46.99
N$26  (via drill 0.6)
  Top 0.406: U8.6 13.97,11.57 v13.97,15.24 | v11.43,39.37 11.43,40.64 10.16,41.91 9.2,41.91 H2.7 | v11.43,24.13 11.43,20.32 v12.7,19.05
  Bottom 0.406: v11.43,24.13 v11.43,39.37 | v12.7,19.05 12.7,17.78 13.97,16.51 v13.97,15.24
N$27  (1 unrouted)
N$28
  Top 0.406: LED3.C R27.2
N$29  (1 unrouted)
N$30  (1 unrouted)
N$31  (1 unrouted)
N$32  (1 unrouted)
N$33  (1 unrouted)
N$34  (1 unrouted)
N$35  (1 unrouted)
N$36  (1 unrouted)
N$37  (1 unrouted)
N$38  (1 unrouted)
N$39  (1 unrouted)
N$40  (1 unrouted)
N$41  (1 unrouted)
N$42  (1 unrouted)
N$43  (2 unrouted)
N$44
  Top 0.406: U13.7 75.88,24.13 73.66,24.13 73.66,22.86 64.77,22.86 63.5,21.59 R9.2
N$45  (1 unrouted)
SS_5V
  Top 0.406: U10.5 39.94,18.06 C15.1
SS_5V1
  Top 0.406: U9.5 36.13,40.92 C4.1
SS_5V2  (1 unrouted)
SW_5V  (via drill 0.7)
  Top 0.406: U10.2 33.97,12.7 30.48,12.7 29.21,13.97 | 29.21,13.97 27.94,15.24 27.09,15.24 C16.2 | L2.P$1 26.67,22.86 26.67,20.32 v27.94,20.32 | v29.21,16.51 29.21,13.97
  Bottom 0.406: v27.94,20.32 27.94,17.78 v29.21,16.51
SW_5V1  (via drill 0.6)
  Top 0.406: U9.2 30.16,36.51 29.21,35.56 25.4,35.56 | C5.2 22.86,36.83 24.13,35.56 25.4,35.56 | 25.4,35.56 v25.4,36.83 | v25.4,43.18 L1.P$1
  Bottom 0.406: v25.4,36.83 v25.4,43.18
SW_5V2  (1 unrouted)
  Top 0.406: U13.2 75.88,17.45 74.93,16.51 71.54,16.51 C21.2
VBST_5V
  Top 0.406: C16.1 27.37,18.06 U10.8
VBST_5V1
  Top 0.406: C5.1 23.56,40.92 U9.8
VBST_5V2
  Top 0.406: U13.8 69.28,21.87 C21.1
VCC  (via drill 0.7, 0.8)
  Top 0.406: H2.2 H2.1 9.31,33.02 10.16,33.02 10.16,31.75 13.97,27.94 v12.7,27.94 | 19.05,13.97 17.78,13.97 17.78,19.05 13.97,19.05 13.97,22.86 v12.7,24.13 | 19.05,13.97 20.32,12.7 20.32,6.77 C12.1 C13.1 C14.1 33.44,6.77 34.62,7.95 U10.3 | 19.05,13.97 v19.05,11.43 | v22.86,11.43 22.86,12.7 21.59,13.97 R26.1
  Bottom 0.406: v12.7,27.94 v12.7,24.13 | v19.05,11.43 v22.86,11.43
VDD  (via drill 0.6, 0.7)  (4 unrouted)
  Top 0.406: U9.3 30.8,33.34 v30.48,33.02 30.48,30.48 29.21,29.21 28.79,29.63 C1.1 C2.1 | C2.1 22.86,29.21 | 18.2,29.21 C3.1 C2.1 | v27.94,33.02 27.94,34.29 24.13,34.29 21.59,36.83 17.78,36.83 R3.1 | H1.8 11.26,75.1 v11.43,74.93 | 10.91,54.09 11.43,54.61 v11.43,62.23 v13.97,62.23 | H1.6 11.14,72.1 v11.43,72.39 | H1.4 10.68,69.1 v11.43,68.58 | H1.2 11.37,66.1 v11.43,66.04 | 10.91,54.09 10.91,53.86 11.43,53.34 11.43,41.91 12.7,40.64 12.7,31.75 13.97,30.48 16.09,30.48 17.36,29.21 | J2.4 J2.3 10.91,54.09 | U2.6 18.41,60.33 v19.05,60.96 | U4.6 24.77,62.87 v24.13,63.5 | C9.1 C10.1 C11.1
  Bottom 0.406: v30.48,33.02 v27.94,33.02 | v11.43,74.93 v11.43,72.39 v11.43,68.58 v11.43,66.04 v11.43,62.23 | v24.13,63.5 24.13,67.31 22.86,68.58 15.24,68.58 13.97,67.31 v13.97,62.23 15.24,60.96 v19.05,60.96
VFB_5V  (via drill 0.6)
  Top 0.406: 35.83,27.94 R24.1 35.56,27.67 35.83,27.94 | 36.83,27.94 R25.2 | U10.6 34.62,20.32 v35.56,20.32 | 35.83,27.94 36.83,27.94 | 36.83,27.94 36.83,26.67 35.56,25.4 v33.02,25.4
  Bottom 0.406: v33.02,25.4 33.02,21.91 34.62,20.32 v35.56,20.32
VFB_5V1  (via drill 0.6)
  Top 0.406: R2.2 R1.1 31.75,50.8 v33.02,49.53 | v31.75,43.18 30.8,43.18 U9.6
  Bottom 0.406: v33.02,49.53 31.75,49.53 v31.75,43.18
VFB_5V2  (2 unrouted)